# Altium project Open_Rally_Computer.PrjPcb
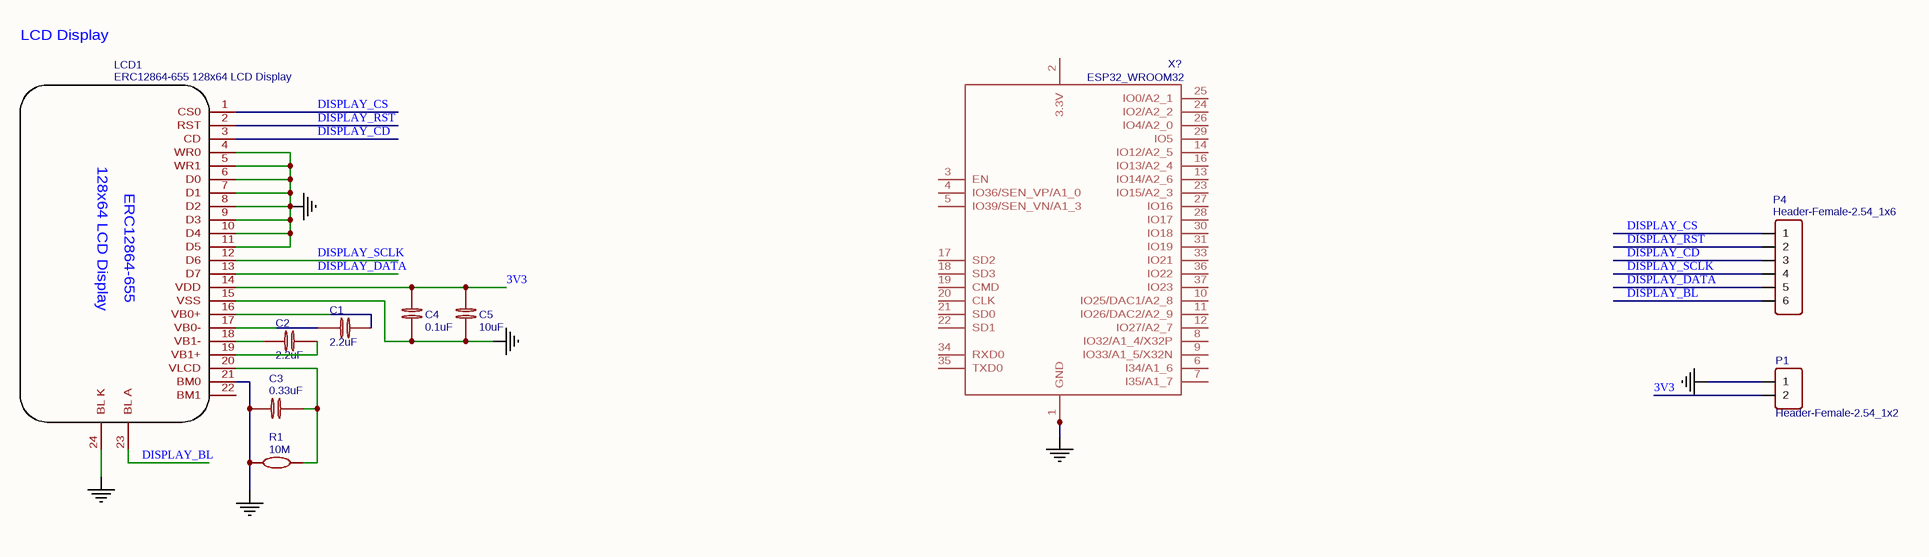
[diagram p0: open-rally-computer_testscreen.schdoc]
1 sheet, 10 parts. Net scope: global (net labels, ports and power ports of the same name join across sheets).
Board file: open-rally-computer_testscreen.pcbdoc

## Sheet open-rally-computer_testscreen.schdoc
size 411 x 275 mm; SheetNumber: 1; SheetTotal: 1

### Parts
C1  2.2uF  [1206]
C2  2.2uF  [1206]
C3  0.33uF  [1206]
C4  0.1uF  [1206]
C5  10uF  [1206]
LCD1  ERC12864-655 128x64 LCD Display  [ERC12864-655]
P1  Header-Female-2.54_1x2  [HDR-1X2/2.54]
P4  Header-Female-2.54_1x6  [HDR-6X1/2.54]
R1  10M  [1206]
X?  ESP32_WROOM32  [WROOM32]

### Nets
GND: C3.1 C4.2 C5.2 LCD1.4(WR0) LCD1.5(WR1) LCD1.6(D0) LCD1.7(D1) LCD1.8(D2) LCD1.9(D3) LCD1.10(D4) LCD1.11(D5) LCD1.15(VSS) LCD1.21(BM0) LCD1.24(BL_K) P1.1 R1.1 X?.1(GND) X?.15(GND) X?.38(GND) X?.P$1(GND)
3V3: C4.1 C5.1 LCD1.14(VDD) P1.2
DISPLAY_BL: LCD1.23(BL_A) P4.6
DISPLAY_CD: LCD1.3(CD) P4.3
DISPLAY_CS: LCD1.1(CS0) P4.1
DISPLAY_DATA: LCD1.13(D7) P4.5
DISPLAY_RST: LCD1.2(RST) P4.2
DISPLAY_SCLK: LCD1.12(D6) P4.4
NetC1_1: C1.1 LCD1.16(VB0+)
NetC1_2: C1.2 LCD1.17(VB0-)
NetC2_1: C2.1 LCD1.18(VB1-)
NetC2_2: C2.2 LCD1.19(VB1+)
NetC3_2: C3.2 LCD1.20(VLCD) R1.2

Not connected (* = marked no-connect by the designer): LCD1 22(BM1); X? 2(3.3V) 3(EN) 4(IO36/SEN_VP/A1_0) 5(IO39/SEN_VN/A1_3) 6(I34/A1_6) 7(I35/A1_7) 8(IO32/A1_4/X32P) 9(IO33/A1_5/X32N) 10(IO25/DAC1/A2_8) 11(IO26/DAC2/A2_9) 12(IO27/A2_7) 13(IO14/A2_6) 14(IO12/A2_5) 16(IO13/A2_4) 17(SD2) 18(SD3) 19(CMD) 20(CLK) 21(SD0) 22(SD1) 23(IO15/A2_3) 24(IO2/A2_2) 25(IO0/A2_1) 26(IO4/A2_0) 27(IO16) 28(IO17) 29(IO5) 30(IO18) 31(IO19) 33(IO21) 34(RXD0) 35(TXD0) 36(IO22) 37(IO23)

### Notes on the sheet
- LCD Display
- (in symbol ERC12864-655 128x64 LCD Display) 128x64 LCD Display

### Library data of the parts
C1 C2 = 2.2uF: nameAlias: Value(F); BOM_Manufacturer Part: ?; spicePre: C; spiceSymbolName: Cap_1206_EU
C3 = 0.33uF: nameAlias: Value(F); BOM_Manufacturer Part: ?; spicePre: C; spiceSymbolName: Cap_1206_EU
C4 = 0.1uF: nameAlias: Value(F); BOM_Manufacturer Part: ?; spicePre: C; spiceSymbolName: Cap_1206_EU
C5 = 10uF: nameAlias: Value(F); BOM_Manufacturer Part: ?; spicePre: C; spiceSymbolName: Cap_1206_EU
LCD1 = ERC12864-655 128x64 LCD Display: BOM_Manufacturer: EastRising Technology Co.; Contributor: mattogodoy; BOM_Manufacturer Part: ERC12864-655; BOM_Supplier: BuyDisplay.com; BOM_Supplier Part: ERC12864-655; link: https://www.buydisplay.com/download/manual/ERC12864-655_Series_Datasheet.pdf; spicePre: L
P1 = Header-Female-2.54_1x2: BOM_Manufacturer: BOOMELE; BOM_Manufacturer Part: 2.54-1*2PFemale; Contributor: LCSC; BOM_Supplier: LCSC; image: //image.lceda.cn/szlcsc/C49661.jpg; BOM_Supplier Part: C49661; spicePre: P
P4 = Header-Female-2.54_1x6: BOM_Manufacturer: BOOMELE; BOM_Manufacturer Part: Female header 1*6p; BOM_Supplier: LCSC; BOM_Supplier Part: C40877; spicePre: P
R1 = 10M: nameAlias: Value(Ω); BOM_Manufacturer Part: ?; spicePre: R; spiceSymbolName: Res_1206(1/4W)_EU
X? = ESP32_WROOM32: Contributor: meggawatts; BOM_Manufacturer Part: ?; spicePre: X